# EAGLE design PCB-Neopixel Control (EAGLE 9.5.2)
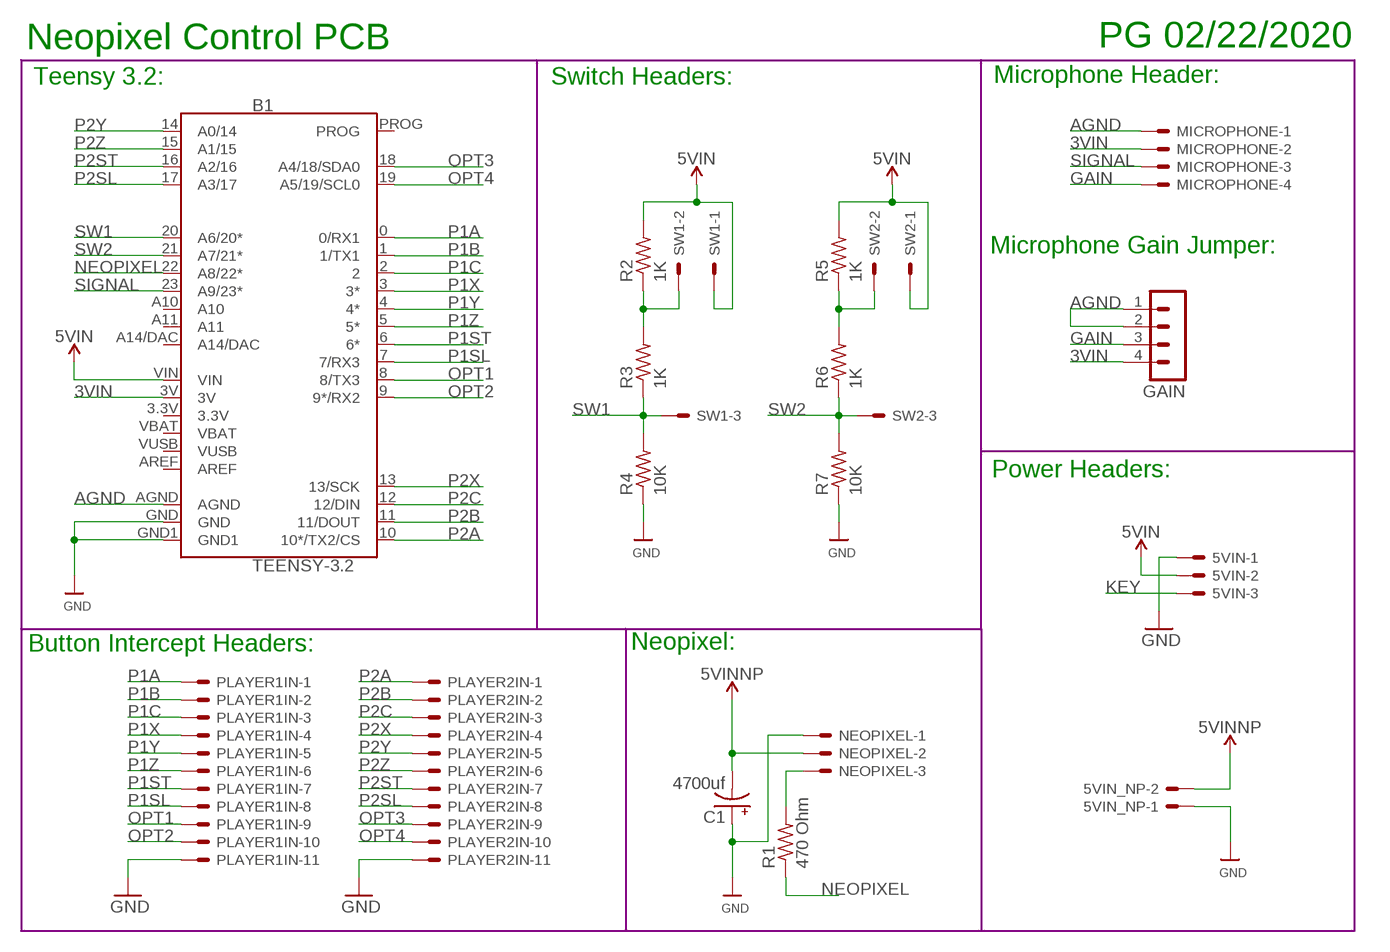
[diagram p0: schematic, sheet 1]

## Parts
5VIN  KK-156-3  [KK-156-3]
5VIN_NP  KK-156-2  [KK-156-2]
B1  TEENSY-3.2  TEENSY-3.1SILK  [TEENSY-3.1]
C1  4700uf  CPOL-USE5-13  [E5-13]
GAIN  MA04-1  [MA04-1]
MICROPHONE  KK-156-4  [KK-156-4]
NEOPIXEL  KK-156-3  [KK-156-3]
PLAYER1IN  KK-156-11  [KK-156-11]
PLAYER2IN  KK-156-11  [KK-156-11]
R1  470 Ohm  R-US_R1206  [R1206]
R2  1K  R-US_R1206  [R1206]
R3  1K  R-US_R1206  [R1206]
R4  10K  R-US_R1206  [R1206]
R5  1K  R-US_R1206  [R1206]
R6  1K  R-US_R1206  [R1206]
R7  10K  R-US_R1206  [R1206]
SW1  KK-156-3  [KK-156-3]
SW2  KK-156-3  [KK-156-3]

## Nets
3VIN: B1.3V GAIN.4 MICROPHONE.2
5VIN: 5VIN.2 B1.VIN R2.2 R5.2 SW1.1 SW2.1
5VINNP: 5VIN_NP.2 C1.- NEOPIXEL.2
AGND: B1.AGND GAIN.1 GAIN.2 MICROPHONE.1
GAIN: GAIN.3 MICROPHONE.4
GND: 5VIN.1 5VIN_NP.1 B1.GND B1.GND1 C1.+ NEOPIXEL.1 PLAYER1IN.11 PLAYER2IN.11 R4.1 R7.1
KEY: 5VIN.3
NEOPIXEL: B1.22(A8/22*) R1.1
NP2T: NEOPIXEL.3 R1.2
OPT1: B1.8(8/TX3) PLAYER1IN.9
OPT2: B1.9(9*/RX2) PLAYER1IN.10
OPT3: B1.18(A4/18/SDA0) PLAYER2IN.9
OPT4: B1.19(A5/19/SCL0) PLAYER2IN.10
P1A: B1.0(0/RX1) PLAYER1IN.1
P1B: B1.1(1/TX1) PLAYER1IN.2
P1C: B1.2 PLAYER1IN.3
P1SL: B1.7(7/RX3) PLAYER1IN.8
P1ST: B1.6(6*) PLAYER1IN.7
P1X: B1.3(3*) PLAYER1IN.4
P1Y: B1.4(4*) PLAYER1IN.5
P1Z: B1.5(5*) PLAYER1IN.6
P2A: B1.10(10*/TX2/CS) PLAYER2IN.1
P2B: B1.11(11/DOUT) PLAYER2IN.2
P2C: B1.12(12/DIN) PLAYER2IN.3
P2SL: B1.17(A3/17) PLAYER2IN.8
P2ST: B1.16(A2/16) PLAYER2IN.7
P2X: B1.13(13/SCK) PLAYER2IN.4
P2Y: B1.14(A0/14) PLAYER2IN.5
P2Z: B1.15(A1/15) PLAYER2IN.6
SIGNAL: B1.23(A9/23*) MICROPHONE.3
SW1: B1.20(A6/20*) R3.1 R4.2 SW1.3
SW1A: R2.1 R3.2 SW1.2
SW2: B1.21(A7/21*) R6.1 R7.2 SW2.3
SW2A: R5.1 R6.2 SW2.2
Unconnected: B1.A10 B1.A11 B1.A14/DAC B1.AREF B1.PROG

## Notes on the sheet
- Neopixel Control PCB | PG 02/22/2020
- Teensy 3.2: | Switch Headers: | Microphone Header:
- Microphone Gain Jumper:
- Power Headers:
- Button Intercept Headers: | Neopixel:

## Power pins joined to a net without a drawn wire
3.3V: B1.3.3V
VBAT: B1.VBAT
VUSB: B1.VUSB

## Library data of the parts
5VIN NEOPIXEL SW1 SW2 = con-molex:KK-156-3: KK 156 HEADER Source: http://www.molex.com/pdm_docs/sd/026604100_sd.pdf; MF: MOLEX; OC_FARNELL: unknown; OC_NEWARK: unknown
5VIN_NP = con-molex:KK-156-2: KK 156 HEADER Source: http://www.molex.com/pdm_docs/sd/026604100_sd.pdf; MF: MOLEX; OC_FARNELL: unknown; OC_NEWARK: unknown
B1 = SparkFun-Boards:TEENSY-3.1: Teensy 3+ Footprint Mechanical footprint with connectors for Teensy Development Board with ARM Cortex. SparkFun Products: Teensy 3.2 <https://www.sparkfun.com/products/13736> Teensy LC <https://www.sparkfun.com/products/13305>; SF_ID: DEV-12646
C1 = adafruit:CPOL-US: POLARIZED CAPACITOR, American symbol
GAIN = con-lstb:MA04-1: PIN HEADER; OC_FARNELL: unknown; OC_NEWARK: unknown
MICROPHONE = con-molex:KK-156-4: KK 156 HEADER Source: http://www.molex.com/pdm_docs/sd/026604100_sd.pdf; MF: MOLEX; OC_FARNELL: unknown; OC_NEWARK: unknown
PLAYER1IN PLAYER2IN = con-molex:KK-156-11: KK 156 HEADER Source: http://www.molex.com/pdm_docs/sd/026604100_sd.pdf; MF: MOLEX; OC_FARNELL: unknown; OC_NEWARK: unknown
R1-R7 = adafruit:R-US_: RESISTOR, American symbol

## Board
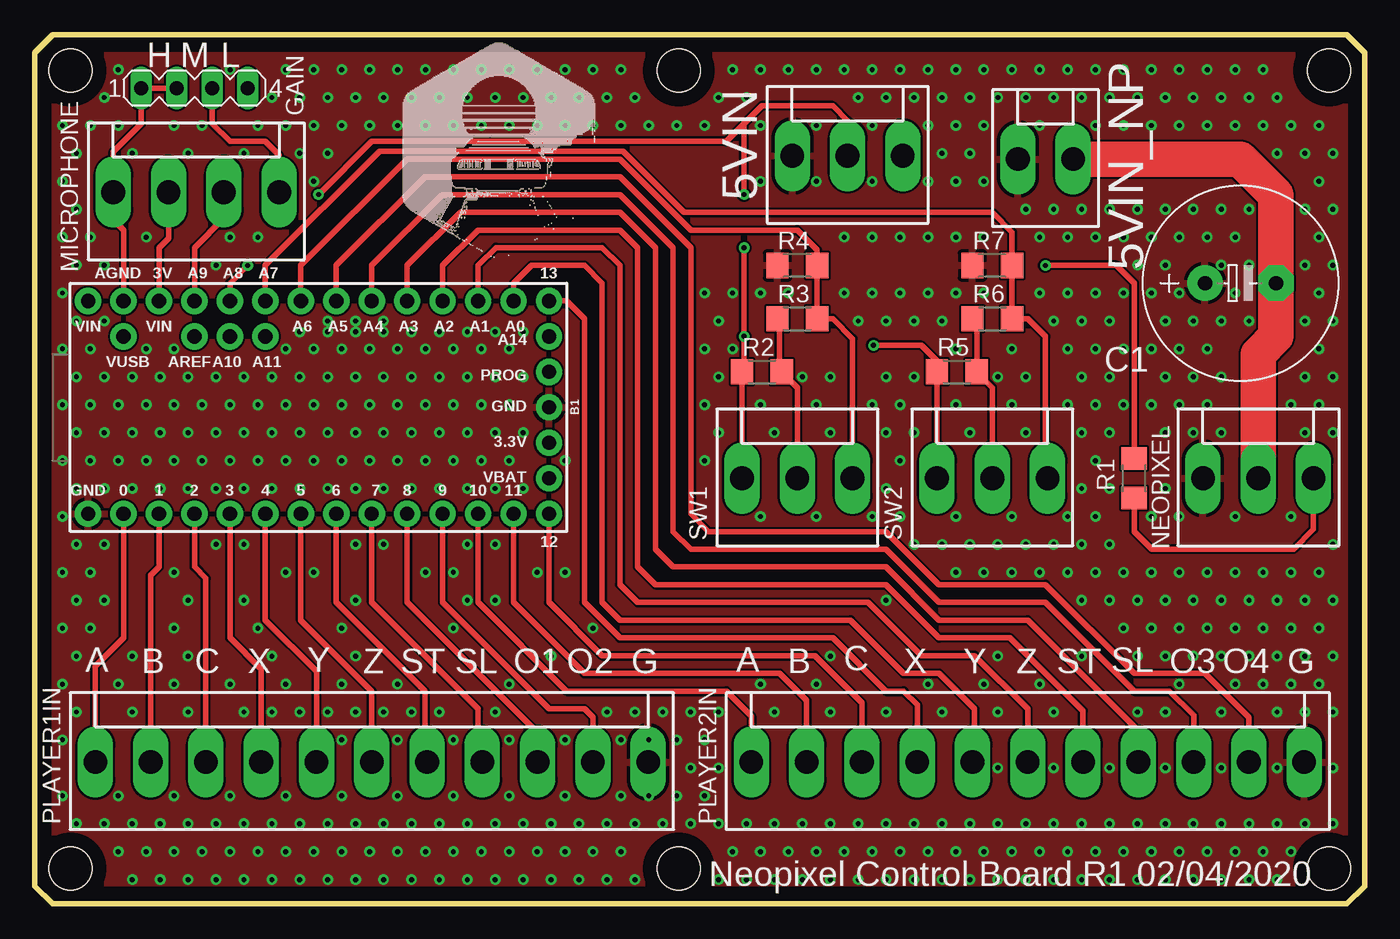
[diagram p1: board, top side]
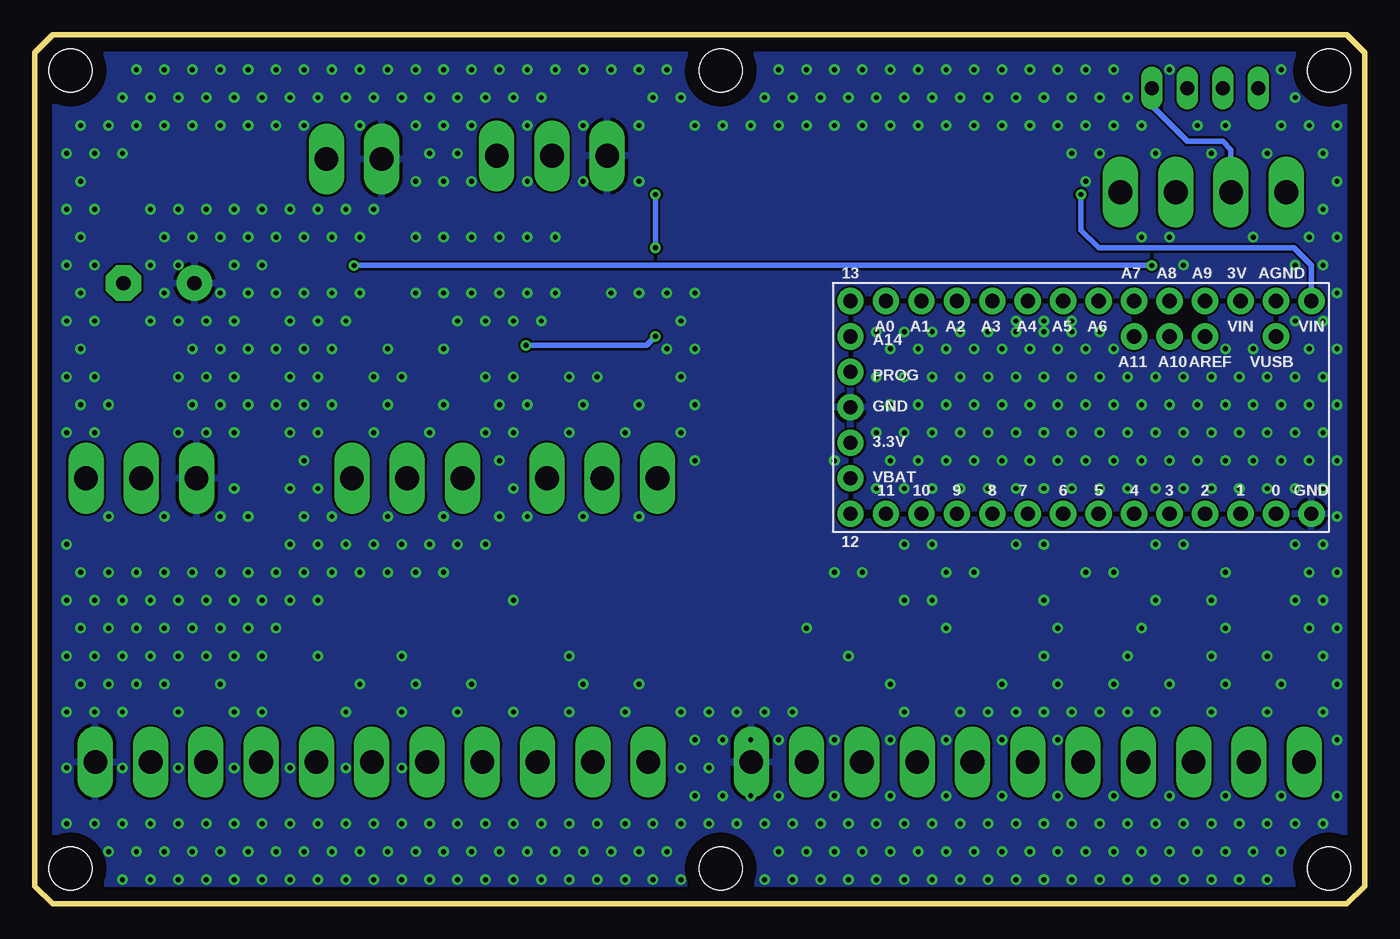
[diagram p2: board, bottom side, seen from below]

Size 95.25 x 62.23 mm. Coordinates in mm from the lower left corner, seen from the top.
Outline: 0,1.27 0,60.96 1.27,62.23 93.98,62.23 95.25,60.96 95.25,1.27 93.98,0 1.27,0 0,1.27
Copper layers (1*16): Top 0.035mm / dielectric 1.5mm / Bottom 0.035mm
Design rules "default": minimum track width 6mil, minimum drill 0.35mm, track to track 6mil, track to pad 6mil, pad to pad 6mil, via to via 6mil, smd to smd 6mil, copper to edge 40mil, drill to drill 6mil, minimum pad ring 10mil, minimum via ring 8mil, stop-mask expansion 4mil, vias tented up to drill 0.5mm, thermal gap 10mil
Holes 3.1 mm at 92.71,59.69 2.54,59.69 2.54,2.54 92.71,2.54 46.12,2.54 46.12,59.69

### Footprints (pad centres in the part's own frame; a part is rotated, then mirrored left to right if it is on the bottom)
KK-156-3 = drill 1.7 pad 2.184 long: 1 -3.96,0; 2 0,0; 3 3.96,0
KK-156-2 = drill 1.7 pad 2.184 long: 1 -1.98,0; 2 1.98,0
TEENSY-3.1 = drill 1.016 pad 1.88: 0 7.62,-13.97; 1 7.62,-11.43; 2 7.62,-8.89; 3 7.62,-6.35; 3.3V 2.54,16.51; 3V -7.62,-11.43; 4 7.62,-3.81; 5 7.62,-1.27; 6 7.62,1.27; 7 7.62,3.81; 8 7.62,6.35; 9 7.62,8.89; 10 7.62,11.43; 11 7.62,13.97; 12 7.62,16.51; 13 -7.62,16.51; 14 -7.62,13.97; 15 -7.62,11.43; 16 -7.62,8.89; 17 -7.62,6.35; 18 -7.62,3.81; 19 -7.62,1.27; 20 -7.62,-1.27; 21 -7.62,-3.81; 22 -7.62,-6.35; 23 -7.62,-8.89; A10 -5.08,-6.35; A11 -5.08,-3.81; A14/DAC -5.08,16.51; AGND -7.62,-13.97; AREF -5.08,-8.89; GND 0,16.51; GND1 7.62,-16.51; PROG -2.54,16.51; VBAT 5.08,16.51; VIN -7.62,-16.51; VUSB -5.08,-13.97
E5-13 = drill 1.016 pad 2.54: + -2.54,0 | drill 1.016 pad 2.54 octagon: - 2.54,0
MA04-1 = drill 1.016 long: 1 -3.81,0; 2 -1.27,0; 3 1.27,0; 4 3.81,0
KK-156-4 = drill 1.7 pad 2.184 long: 1 -5.94,0; 2 -1.98,0; 3 1.98,0; 4 5.94,0
KK-156-11 = drill 1.7 pad 2.184 long: 1 -19.8,0; 2 -15.84,0; 3 -11.88,0; 4 -7.92,0; 5 -3.96,0; 6 0,0; 7 3.96,0; 8 7.92,0; 9 11.88,0; 10 15.84,0; 11 19.8,0
R1206 = smd 1.6 x 1.803: 1 -1.422,0; 2 1.422,0

### Placement (x,y rotation side)
5VIN  58.21,53.57 0 top
5VIN_NP  72.39,53.34 0 top
B1  20.32,35.56 270 top
C1  86.36,44.45 0 top
GAIN  11.43,58.42 0 top
MICROPHONE  11.55,50.97 0 top
NEOPIXEL  87.63,30.48 0 top
PLAYER1IN  24.13,10.16 0 top
PLAYER2IN  71.12,10.16 0 top
R1  78.74,30.48 270 top
R2  52.07,38.1 180 top
R3  54.61,41.91 180 top
R4  54.61,45.72 0 top
R5  66.04,38.1 180 top
R6  68.58,41.91 180 top
R7  68.58,45.72 0 top
SW1  54.61,30.48 0 top
SW2  68.58,30.48 0 top

### Tracks (layer width: path | path; a pad name or v marks a point on that pad's centre or on a via)
3VIN
  Top 0.406: MICROPHONE.2 9.57,47.67 8.89,46.99 B1.3V
  Bottom 0.406: MICROPHONE.2 9.57,54.02 10.16,54.61 12.7,54.61 15.24,57.15 GAIN.4
5VIN  (via drill 0.35)
  Top 0.406: SW1.1 R2.2 | R2.2 | SW2.1 R5.2 64.62,38.89 63.5,40.01 v60.07,40.01 | R2.2 50.8,38.25 v50.8,40.64 v50.8,46.99 | 5VIN.2 58.21,56.09 57.15,57.15 52.07,57.15 50.8,55.88 | v20.32,50.8 24.13,54.61 49.53,54.61 50.8,55.88 | v50.8,50.8 50.8,55.88
  Bottom 0.406: v60.07,40.01 51.44,40.01 v50.8,40.64 | v50.8,46.99 v50.8,50.8 | v20.32,50.8 20.32,48.26 19.05,46.99 5.08,46.99 3.81,45.72 B1.VIN
5VINNP
  Top 2.54: 5VIN_NP.2 86.36,53.34 88.9,50.8 C1.- 88.9,40.64 87.63,39.37 NEOPIXEL.2
AGND
  Top 0.406: GAIN.2 GAIN.1 7.62,55.88 5.61,53.87 MICROPHONE.1 5.61,49 6.35,48.26 B1.AGND
GAIN
  Top 0.406: MICROPHONE.4 17.49,53.63 16.51,54.61 13.97,54.61 12.7,55.88 GAIN.3
GND  (via drill 0.35)
  other vias: 18.98,40.97 20.98,40.97 22.98,40.97 24.98,40.97 26.98,40.97 28.98,40.97 30.98,40.97 32.98,40.97 34.98,40.97 2.98,5.75 1.98,7.75 1.98,11.75 2.98,13.75 1.98,15.75 2.98,17.75 1.98,19.75 2.98,21.75 1.98,23.75 2.98,25.75 1.98,27.75 2.98,29.75 1.98,31.75 2.98,33.75 1.98,35.75 2.98,37.75 1.98,39.75 2.98,41.75 1.98,43.75 2.98,45.75 1.98,47.75 2.98,49.75 1.98,51.75 2.98,53.75 1.98,55.75 4.98,5.75 3.98,19.75 4.98,21.75 3.98,23.75 4.98,25.75 4.98,29.75 3.98,31.75 4.98,33.75 3.98,35.75 4.98,37.75 3.98,39.75 4.98,41.75 4.98,45.75 3.98,47.75 3.98,55.75 4.98,57.75 6.98,1.75 5.98,3.75 6.98,5.75 5.98,7.75 6.98,13.75 5.98,15.75 6.98,17.75 6.98,29.75 5.98,31.75 6.98,33.75 5.98,35.75 6.98,37.75 6.98,53.75 5.98,55.75 5.98,59.75 8.98,1.75 7.98,3.75 8.98,5.75 8.98,29.75 7.98,31.75 8.98,33.75 7.98,35.75 8.98,37.75 7.98,39.75 7.98,47.75 10.98,1.75 9.98,3.75 10.98,5.75 9.98,7.75 10.98,13.75 9.98,15.75 10.98,17.75 9.98,19.75 10.98,21.75 9.98,23.75 10.98,29.75 9.98,31.75 10.98,33.75 9.98,35.75 10.98,37.75 9.98,39.75 10.98,53.75 9.98,55.75 12.98,1.75 11.98,3.75 12.98,5.75 12.98,25.75 12.98,29.75 11.98,31.75 12.98,33.75 11.98,35.75 12.98,37.75 12.98,45.75 11.98,55.75 14.98,1.75 13.98,3.75 14.98,5.75 13.98,7.75 14.98,13.75 13.98,15.75 14.98,21.75 14.98,25.75 14.98,29.75 13.98,31.75 14.98,33.75 13.98,35.75 14.98,37.75 13.98,47.75 14.98,53.75 13.98,59.75 16.98,1.75 15.98,3.75 16.98,5.75 16.98,13.75 16.98,17.75 15.98,19.75 16.98,29.75 15.98,31.75 16.98,33.75 15.98,35.75 16.98,37.75 15.98,47.75 15.98,55.75 16.98,57.75 18.98,1.75 17.98,3.75 18.98,5.75 17.98,7.75 18.98,13.75 17.98,15.75 17.98,23.75 18.98,29.75 17.98,31.75 18.98,33.75 17.98,35.75 18.98,37.75 17.98,39.75 18.98,53.75 17.98,55.75 18.98,57.75 17.98,59.75 20.98,1.75 19.98,3.75 20.98,5.75 20.98,13.75 19.98,23.75 20.98,29.75 19.98,31.75 20.98,33.75 19.98,35.75 20.98,37.75 19.98,39.75 20.98,41.75 19.98,51.75 20.98,53.75 19.98,55.75 20.98,57.75 19.98,59.75 22.98,1.75 21.98,3.75 22.98,5.75 21.98,7.75 21.98,11.75 22.98,13.75 21.98,15.75 22.98,17.75 21.98,19.75 22.98,21.75 22.98,25.75 22.98,29.75 21.98,31.75 22.98,33.75 21.98,35.75 22.98,37.75 21.98,39.75 22.98,41.75 21.98,55.75 22.98,57.75 21.98,59.75 24.98,1.75 23.98,3.75 24.98,5.75 24.98,13.75 24.98,25.75 24.98,29.75 23.98,31.75 24.98,33.75 23.98,35.75 24.98,37.75 23.98,39.75 24.98,41.75 23.98,55.75 24.98,57.75 23.98,59.75 26.98,1.75 25.98,3.75 26.98,5.75 25.98,7.75 25.98,11.75 26.98,13.75 25.98,15.75 26.98,29.75 25.98,31.75 26.98,33.75 25.98,35.75 26.98,37.75 25.98,39.75 25.98,55.75 26.98,57.75 25.98,59.75 28.98,1.75 27.98,3.75 28.98,5.75 28.98,13.75 27.98,23.75 28.98,29.75 27.98,31.75 28.98,33.75 27.98,35.75 28.98,37.75 27.98,39.75 27.98,55.75 28.98,57.75 27.98,59.75 30.98,1.75 29.98,3.75 30.98,5.75 29.98,7.75 29.98,11.75 29.98,19.75 30.98,21.75 29.98,23.75 30.98,25.75 30.98,29.75 29.98,31.75 30.98,33.75 29.98,35.75 30.98,37.75 29.98,39.75 29.98,55.75 30.98,57.75 29.98,59.75 32.98,1.75 31.98,3.75 32.98,5.75 32.98,13.75 32.98,21.75 32.98,25.75 32.98,29.75 31.98,31.75 32.98,33.75 31.98,35.75 32.98,37.75 31.98,39.75 31.98,55.75 32.98,57.75 31.98,59.75 34.98,1.75 33.98,3.75 34.98,5.75 33.98,7.75 33.98,11.75 33.98,15.75 34.98,29.75 33.98,31.75 34.98,33.75 33.98,35.75 34.98,37.75 33.98,39.75 33.98,55.75 34.98,57.75 33.98,59.75 36.98,1.75 35.98,3.75 36.98,5.75 36.98,17.75 35.98,23.75 35.98,55.75 36.98,57.75 35.98,59.75 38.98,1.75 37.98,3.75 38.98,5.75 37.98,7.75 37.98,11.75 37.98,23.75 37.98,31.75 37.98,55.75 38.98,57.75 37.98,59.75 40.98,1.75 39.98,3.75 40.98,5.75 40.98,13.75 39.98,19.75 39.98,55.75 40.98,57.75 39.98,59.75 42.98,1.75 41.98,3.75 42.98,5.75 41.98,7.75 41.98,11.75 42.98,13.75 41.98,55.75 42.98,57.75 41.98,59.75 44.98,5.75 43.98,7.75 43.98,11.75 44.98,13.75 43.98,55.75 46.98,5.75 45.98,7.75 46.98,9.75 45.98,11.75 46.98,13.75 45.98,55.75 48.98,1.75 48.98,5.75 47.98,7.75 48.98,9.75 47.98,11.75 48.98,13.75 47.98,31.75 48.98,33.75 47.98,35.75 48.98,37.75 47.98,39.75 48.98,41.75 47.98,43.75 47.98,55.75 48.98,57.75 50.98,1.75 49.98,3.75 50.98,5.75 49.98,39.75 49.98,43.75 50.98,57.75 49.98,59.75 52.98,1.75 51.98,3.75 52.98,5.75 52.98,13.75 51.98,15.75 51.98,27.75 52.98,33.75 51.98,35.75 51.98,43.75 51.98,51.75 51.98,55.75 51.98,59.75 54.98,1.75 53.98,3.75 54.98,5.75 54.98,37.75 53.98,43.75 53.98,59.75 56.98,1.75 55.98,3.75 56.98,5.75 56.98,13.75 55.98,15.75 56.98,17.75 55.98,27.75 56.98,33.75 55.98,35.75 56.98,37.75 55.98,51.75 55.98,55.75 55.98,59.75 58.98,1.75 57.98,3.75 58.98,5.75 58.98,41.75 57.98,43.75 57.98,47.75 58.98,57.75 57.98,59.75 60.98,1.75 59.98,3.75 60.98,5.75 60.98,13.75 60.98,21.75 59.98,27.75 60.98,29.75 60.98,33.75 59.98,35.75 60.98,37.75 60.98,41.75 59.98,43.75 59.98,47.75 59.98,51.75 59.98,55.75 60.98,57.75 59.98,59.75 62.98,1.75 61.98,3.75 62.98,5.75 62.98,25.75 61.98,27.75 61.98,31.75 62.98,33.75 61.98,35.75 62.98,37.75 62.98,41.75 61.98,43.75 61.98,47.75 62.98,57.75 61.98,59.75 64.98,1.75 63.98,3.75 64.98,5.75 64.98,13.75 63.98,15.75 64.98,25.75 64.98,41.75 63.98,43.75 63.98,47.75 63.98,51.75 64.98,53.75 63.98,55.75 64.98,57.75 63.98,59.75 66.98,1.75 65.98,3.75 66.98,5.75 65.98,23.75 66.98,25.75 65.98,27.75 66.98,33.75 65.98,35.75 65.98,39.75 65.98,43.75 65.98,47.75 65.98,51.75 66.98,53.75 65.98,55.75 66.98,57.75 65.98,59.75 68.98,1.75 67.98,3.75 68.98,5.75 68.98,9.75 68.98,13.75 67.98,15.75 68.98,17.75 67.98,23.75 68.98,25.75 68.98,37.75 67.98,43.75 67.98,47.75 67.98,51.75 67.98,55.75 68.98,57.75 67.98,59.75 70.98,1.75 69.98,3.75 70.98,5.75 69.98,23.75 70.98,25.75 69.98,27.75 70.98,33.75 69.98,35.75 70.98,37.75 69.98,39.75 70.98,49.75 70.98,57.75 69.98,59.75 72.98,1.75 71.98,3.75 72.98,5.75 72.98,9.75 72.98,13.75 71.98,15.75 71.98,23.75 72.98,25.75 72.98,41.75 71.98,43.75 71.98,47.75 72.98,49.75 71.98,55.75 72.98,57.75 71.98,59.75 74.98,1.75 73.98,3.75 74.98,5.75 74.98,17.75 74.98,21.75 73.98,23.75 74.98,25.75 73.98,27.75 74.98,29.75 74.98,33.75 73.98,35.75 74.98,37.75 73.98,39.75 74.98,41.75 73.98,43.75 73.98,47.75 74.98,49.75 74.98,57.75 73.98,59.75 76.98,1.75 75.98,3.75 76.98,5.75 76.98,9.75 76.98,21.75 75.98,23.75 76.98,25.75 75.98,27.75 76.98,29.75 75.98,31.75 76.98,33.75 75.98,35.75 76.98,37.75 75.98,39.75 76.98,41.75 75.98,43.75 75.98,47.75 76.98,49.75 75.98,55.75 76.98,57.75 75.98,59.75 78.98,1.75 77.98,3.75 78.98,5.75 78.98,13.75 78.98,17.75 77.98,19.75 78.98,21.75 77.98,23.75 77.98,35.75 77.98,39.75 77.98,43.75 78.98,45.75 77.98,47.75 78.98,49.75 77.98,55.75 78.98,57.75 77.98,59.75 80.98,1.75 79.98,3.75 80.98,5.75 80.98,9.75 80.98,13.75 80.98,17.75 79.98,19.75 80.98,21.75 79.98,23.75 79.98,27.75 80.98,29.75 80.98,33.75 79.98,35.75 80.98,37.75 79.98,39.75 80.98,41.75 79.98,43.75 80.98,45.75 79.98,47.75 80.98,49.75 79.98,55.75 80.98,57.75 79.98,59.75 82.98,1.75 81.98,3.75 82.98,5.75 81.98,15.75 82.98,17.75 81.98,19.75 82.98,21.75 81.98,23.75 81.98,27.75 82.98,33.75 81.98,35.75 82.98,37.75 81.98,39.75 82.98,41.75 81.98,43.75 81.98,47.75 82.98,49.75 81.98,55.75 82.98,57.75 81.98,59.75 84.98,1.75 83.98,3.75 84.98,5.75 84.98,9.75 84.98,13.75 84.98,17.75 83.98,19.75 84.98,21.75 83.98,23.75 84.98,33.75 83.98,35.75 84.98,37.75 83.98,39.75 84.98,41.75 84.98,45.75 83.98,47.75 84.98,49.75 83.98,55.75 84.98,57.75 83.98,59.75 86.98,1.75 85.98,3.75 86.98,5.75 85.98,15.75 86.98,17.75 85.98,19.75 86.98,21.75 85.98,23.75 85.98,27.75 86.98,41.75 85.98,43.75 86.98,45.75 85.98,47.75 86.98,49.75 85.98,55.75 86.98,57.75 85.98,59.75 88.98,1.75 87.98,3.75 88.98,5.75 88.98,9.75 88.98,13.75 87.98,15.75 88.98,17.75 87.98,19.75 88.98,21.75 87.98,23.75 88.98,53.75 87.98,55.75 88.98,57.75 87.98,59.75 89.98,3.75 90.98,5.75 90.98,13.75 89.98,15.75 90.98,17.75 89.98,19.75 90.98,21.75 89.98,23.75 89.98,27.75 90.98,33.75 89.98,35.75 90.98,37.75 90.98,41.75 90.98,45.75 90.98,49.75 90.98,53.75 89.98,55.75 92.98,5.75 92.98,9.75 92.98,13.75 91.98,15.75 92.98,17.75 91.98,19.75 92.98,21.75 91.98,23.75 92.98,25.75 92.98,33.75 91.98,35.75 92.98,37.75 91.98,39.75 92.98,41.75 91.98,43.75 92.98,45.75 91.98,47.75 92.98,49.75 91.98,51.75 92.98,53.75 91.98,55.75
  pour Top: 0,0 0,62.23 93.98,62.23 arc-90 95.25,60.96 95.25,1.27 arc-90 93.98,0
  pour Bottom: 0,0 0,62.23 93.98,62.23 arc-90 95.25,60.96 95.25,1.27 arc-90 93.98,0
NEOPIXEL  (via drill 0.35)
  Top 0.406: v15.24,45.72 13.97,44.45 B1.22 | v72.39,45.72 77.47,45.72 78.74,44.45 R1.1
  Bottom 0.406: v72.39,45.72 v15.24,45.72
NP2T
  Top 0.406: NEOPIXEL.3 91.59,26.82 90.17,25.4 80.01,25.4 78.74,26.67 R1.2
OPT1
  Top 0.406: PLAYER1IN.9 36.01,12.25 26.67,21.59 B1.8
OPT2
  Top 0.406: B1.9 29.21,21.59 36.83,13.97 39.37,13.97 39.97,13.37 PLAYER1IN.10
OPT3
  Top 0.406: B1.18 24.13,45.72 29.21,50.8 41.91,50.8 45.72,46.99 45.72,26.67 46.99,25.4 60.96,25.4 64.77,21.59 72.39,21.59 78.74,15.24 81.28,15.24 83,13.52 PLAYER2IN.9
OPT4
  Top 0.406: B1.19 21.59,45.72 27.94,52.07 41.91,52.07 46.99,46.99 46.99,27.94 48.26,26.67 60.96,26.67 64.77,22.86 72.39,22.86 78.74,16.51 83.82,16.51 86.96,13.37 PLAYER2IN.10
P1A
  Top 0.406: PLAYER1IN.1 4.33,17.03 6.35,19.05 B1.0
P1B
  Top 0.406: B1.1 8.89,24.13 8.29,23.53 PLAYER1IN.2
P1C
  Top 0.406: PLAYER1IN.3 12.25,23.31 11.43,24.13 B1.2
P1SL
  Top 0.406: PLAYER1IN.8 31.75,10.46 31.75,13.97 24.13,21.59 B1.7
P1ST
  Top 0.406: PLAYER1IN.7 27.94,10.31 27.94,15.24 21.59,21.59 B1.6
P1X
  Top 0.406: PLAYER1IN.4 16.21,16.81 13.97,19.05 B1.3
P1Y
  Top 0.406: PLAYER1IN.5 20.17,16.66 16.51,20.32 B1.4
P1Z
  Top 0.406: PLAYER1IN.6 24.13,15.24 19.05,20.32 B1.5
P2A
  Top 0.406: B1.10 31.75,21.59 38.1,15.24 49.53,15.24 51.32,13.45 PLAYER2IN.1
P2B
  Top 0.406: B1.11 34.29,21.59 39.37,16.51 53.34,16.51 55.28,14.57 PLAYER2IN.2
P2C
  Top 0.406: B1.12 36.83,21.59 40.64,17.78 55.88,17.78 59.24,14.42 PLAYER2IN.3
P2SL
  Top 0.406: B1.17 26.67,45.72 30.48,49.53 41.91,49.53 44.45,46.99 44.45,25.4 45.72,24.13 60.96,24.13 64.77,20.32 71.12,20.32 79.04,12.4 PLAYER2IN.8
P2ST
  Top 0.406: B1.16 29.21,45.72 31.75,48.26 41.91,48.26 43.18,46.99 43.18,24.13 44.45,22.86 60.96,22.86 64.77,19.05 69.85,19.05 75.08,13.82 PLAYER2IN.7
P2X
  Top 0.406: B1.13 38.1,43.18 39.37,41.91 39.37,21.59 41.91,19.05 57.15,19.05 60.96,15.24 62.23,15.24 63.2,14.27 PLAYER2IN.4
P2Y
  Top 0.406: B1.14 34.29,44.45 35.56,45.72 39.37,45.72 40.64,44.45 40.64,21.59 41.91,20.32 58.42,20.32 62.23,16.51 64.77,16.51 67.31,13.97 67.31,10.31 PLAYER2IN.5
P2Z
  Top 0.406: B1.15 31.75,45.72 33.02,46.99 40.64,46.99 41.91,45.72 41.91,22.86 43.18,21.59 59.69,21.59 63.5,17.78 67.31,17.78 71.12,13.97 PLAYER2IN.6
SIGNAL
  Top 0.406: MICROPHONE.3 13.53,49.09 11.43,46.99 B1.23
SW1
  Top 0.406: B1.20 19.05,45.72 26.67,53.34 41.91,53.34 46.99,48.26 54.61,48.26 56.03,46.84 R4.2 R3.1 57.15,41.91 58.57,40.49 SW1.3
SW1A
  Top 0.406: R3.2 53.34,41.76 53.34,38.25 R2.1 54.61,36.98 SW1.2
SW2
  Top 0.406: B1.21 16.51,45.72 24.69,53.9 42.14,53.9 46.51,49.53 68.58,49.53 70,48.11 R7.2 R6.1 71.12,41.91 72.39,40.64 72.39,30.63 SW2.3
SW2A
  Top 0.406: SW2.2 68.58,36.98 R5.1 67.46,41.61 R6.2

### Text on the board
tPlace: H | M | L | A | B | C | X | Y | O1 | O2 | A | B | C | X | SL | O3 | O4 | Z | ST | SL | G | Y | Z | ST | G | Neopixel Control Board R1 02/04/2020